# Altium schematic sheet main_sheet.SchDoc
size A; Author: Erick Miranda Quinde; DrawnBy: Erick Miranda Quinde; Engineer: Erick Miranda Quinde; DocumentNumber: 0000-0000-0001; Revision: V1.0; SheetNumber: 1; SheetTotal: 4
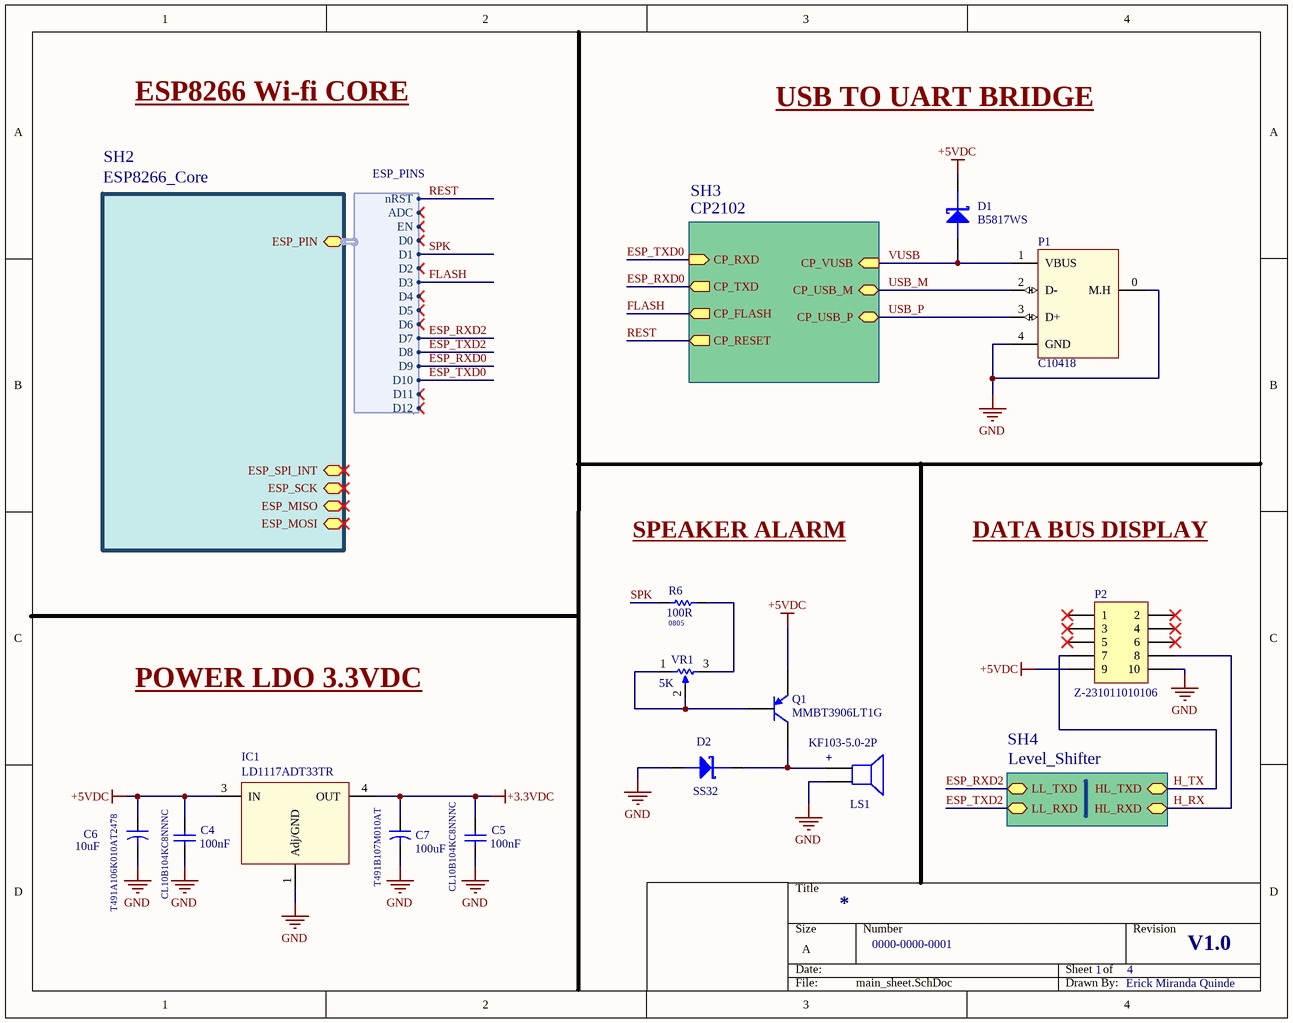
[diagram p0: main_sheet.SchDoc]

## Parts
C4  CL10B104KC8NNNC  value 100nF  [C0603C104K5RACTU]
C5  CL10B104KC8NNNC  value 100nF  [C0603C104K5RACTU]
C6  T491A106K010AT2478  value 10uF  [3216 Case-A]
C7  T491B107M010AT  value 100uF  [TAJB107M006RNJ]
D1  B5817WS  [Diode S4]
D2  SS32  [DO-214AC)]
IC1  LD1117ADT33TR  [TO252]
LS1  KF103-5.0-2P  [VERDE 2pin]
P1  C10418  [USB_MICRO_B_AT]
P2  Z-231011010106  [IDC5X2]
Q1  MMBT3906LT1G  [SOT-23-TT3_N]
R6  value 100R  Package: 0805  [RES-0805]  (hidden comment: TC0525D1000T5E)
VR1  value 5K  [POT LIN VR1]  (hidden comment: 3362P-1-502LF)

## Sub-sheets
SH2 = ESP8266_Core: ESP_PIN (harness ESP_PINS), ESP_SCK, ESP_MISO, ESP_MOSI, ESP_SPI_INT
SH3 = CP2102: CP_USB_M (bidir), CP_USB_P (bidir), CP_VUSB (in), CP_RXD (in), CP_TXD (out), CP_FLASH (out), CP_RESET (out)
SH4 = Level_Shifter: HL_TXD, HL_RXD, LL_TXD, LL_RXD

## Harnesses
ESP_PINS: D12, D11, D10, D9, D3, D8, D7, D6, D5, D4, D2, D1, D0, EN, ADC, nRST

## Nets
+3.3VDC: C5.2 C7.1 IC1.4(OUT)
+5VDC: C4.2 C6.1 D1.1(K) IC1.3(IN) P2.9 Q1.2(E)
GND: C4.1 C5.1 C6.2 C7.2 D2.2(A) IC1.1(Adj/GND) LS1.2 P1.0(M.H) P1.4(GND) P2.10
ESP_RXD0: sheet SH3/CP_TXD, sheet SH2/ESP_PIN.D9
ESP_RXD2: sheet SH4/LL_TXD, sheet SH2/ESP_PIN.D7
ESP_TXD0: sheet SH3/CP_RXD, sheet SH2/ESP_PIN.D10
ESP_TXD2: sheet SH4/LL_RXD, sheet SH2/ESP_PIN.D8
FLASH: sheet SH3/CP_FLASH, sheet SH2/ESP_PIN.D3
H_RX: P2.8 ; sheet SH4/HL_RXD
H_TX: P2.7 ; sheet SH4/HL_TXD
REST: sheet SH3/CP_RESET, sheet SH2/ESP_PIN.nRST
SPK: R6.1 ; sheet SH2/ESP_PIN.D1
USB_M: P1.2(D-) ; sheet SH3/CP_USB_M
USB_P: P1.3(D+) ; sheet SH3/CP_USB_P
VUSB: D1.2(A) P1.1(VBUS) ; sheet SH3/CP_VUSB
NetD2_1: D2.1(K) LS1.1 Q1.3(C)
NetQ1_1: Q1.1(B) VR1.1 VR1.2
NetR6_2: R6.2 VR1.3

Not connected (* = marked no-connect by the designer): P2 1* 2* 3* 4* 5* 6*

## Notes on the sheet
- ESP8266 Wi-fi CORE
- USB TO UART BRIDGE
- SPEAKER ALARM
- DATA BUS DISPLAY
- POWER LDO 3.3VDC
- (near LS1) +

## Library data of the parts
C4 C5 = Cap 100nF (0603): PART_NUM: CL10B104KC8NNNC; Price: $0.02; Link Store: https://lcsc.com/product-detail/Multilayer-Ceramic-Capacitors-MLCC-SMD-SMT_SAMSUNG_CL10B104KC8NNNC_100nF-104-10-100V_C15725.html; LCSC Part: C15725
C6 = T491A106M006AT: CAP TANT 10UF 6.3V 20% 1206; Price: $0.11; Link Store: https://lcsc.com/product-detail/Tantalum-Capacitors_KEMET_T491A106K010AT_10uF-106-10-10V_C110052.html; LCSC Part: C110052
C7 = Cap 10uF (C3216): Capacitor; Price: $0.29; Link Store: https://lcsc.com/product-detail/Tantalum-Capacitors_KEMET-T491B107M010AT_C90975.html; LCSC Part: C90975
D1 = 1N5817: Price: $0.0211; Link Store: https://lcsc.com/product-detail/Schottky-Barrier-Diodes-SBD_Shikues-B5817WS_C122854.html; LCSC Part: C122854
D2 = CD214A-B340LF: DIODE SCHOTTKY 40V 3A SMA; Price: $0.03; Link Store: https://lcsc.com/product-detail/Schottky-Barrier-Diodes-SBD_MDD-Microdiode-Electronics-SS32_C34897.html; LCSC Part: C34897
IC1 = LM1117DT: 800mA Low-Dropout Linear Regulator; Manufacturer: National Semiconductor; Datasheet: http://www.national.com/ds/LM/LM1117.pdf; Price: $0.96; Link Store: https://lcsc.com/product-detail/Low-Dropout-Regulators-LDO_STMicroelectronics-LD1117ADT33TR_C157401.html; LCSC Part: C157401
LS1 = Speaker: Published: 24-Mar-1999; LatestRevisionDate: 17-Jul-2002; LatestRevisionNote: Re-released for DXP Platform.; PackageReference: PIN2; Publisher: Altium Limited; Price: $0.12; Link Store: https://lcsc.com/product-detail/New-Quadratic-Unclassified-Data_Cixi-Kefa-Elec-KF103-5-0-2P_C475088.html; LCSC Part: C475088
P1 = USB Mini: USB Micro; Price: $0.06; Link Store: https://lcsc.com/product-detail/USB-Connectors_Jing-Extension-of-the-Electronic-Co-Jing-Extension-of-the-Electronic-Co-MICRO-USB-5S-B-Type-horns-High-temperature_C10418.html; LCSC Part: C10418
P2 = IDC  5X2: Header, 5-Pin, Dual row; LatestRevisionDate: 17-Jul-2002; LatestRevisionNote: Re-released for DXP Platform.; Publisher: Altium Limited; Price: $0.16; Link Store: https://lcsc.com/product-detail/IDC-Connectors_nextron-Nextronics-Engineering-Z-231011010106_C221045.html; LCSC Part: C221045
Q1 = 2N3906: Manufacturer: Micro Commercial Co; Manufacturer Part Number: 2N3906-AP; Transistor Type: PNP; Current - Collector (Ic) (Max): 200mA; Voltage - Collector Emitter Breakdown (Max): 40V; Vce Saturation (Max) @ Ib, Ic: 400mV @ 5mA, 50mA; DC Current Gain (hFE) (Min) @ Ic, Vce: 100 @ 10mA, 1V; Power - Max: 600mW; Frequency - Transition: 250MHz; Supplier 1: Digi-Key; RoHS: RoHS Compliant; Category: Discrete Semiconductor Products; Stock 1: 54000; Pricing 1: 2000=0.0306, 6000=0.0276, 10000=0.024, 50000=0.0192, 100000=0.018, 200000=0.01596 (USD); Packaging: Tape & Box (TB); Current - Collector Cutoff (Max): -; Mounting Type: Through Hole; Package / Case: TO-226-3, TO-92-3 (TO-226AA) Formed Leads; Supplier Device Package: TO-92; ComponentLink1URL: http://www.mccsemi.com/up_pdf/2N3906(TO-92).pdf; ComponentLink1Description: http://www.mccsemi.com/up_pdf/2N3906(TO-92).pdf; Supplier Part Number 1: 2N3906-APTB-ND; Price: $0.0072; Link Store: https://lcsc.com/product-detail/Transistors-NPN-PNP_ON-Semiconductor-MMBT3906LT1G_C53444.html; LCSC Part: C53444
R6 = Resistor: Published: 8-Jun-2000; LatestRevisionDate: 17-Jul-2002; LatestRevisionNote: Re-released for DXP Platform.; PackageReference: AXIAL-0.3; Publisher: Altium Limited; PackageDescription: Axial Device, Thru-Hole; 2 Leads; 0.3 in Pin Spacing; Price: $0.024; Link Store: https://lcsc.com/product-detail/High-Precision-Low-TCR-SMD-Resistors_UNI-ROYAL-Uniroyal-Elec-TC0525D1000T5E_C44786.html; LCSC Part: C44786
VR1 = Trimmer Cermet 104: Price: $0.22; PARTNUM: 3362P-1-502LF; Link Store: https://lcsc.com/product-detail/Precision-Potentiometer_BOURNS_3362P-1-502LF_5KR_C81260.html; LCSC Part: C81260